# Altium project Dashcam.PrjPcb (part 5 of 8)

## Sheet GNSS_GPS.SchDoc
size A4; DrawnBy: Elio F; Engineer: Elio F; Revision: A; SheetNumber: 17; SheetTotal: 22; Sheet Title: Gnns Gps
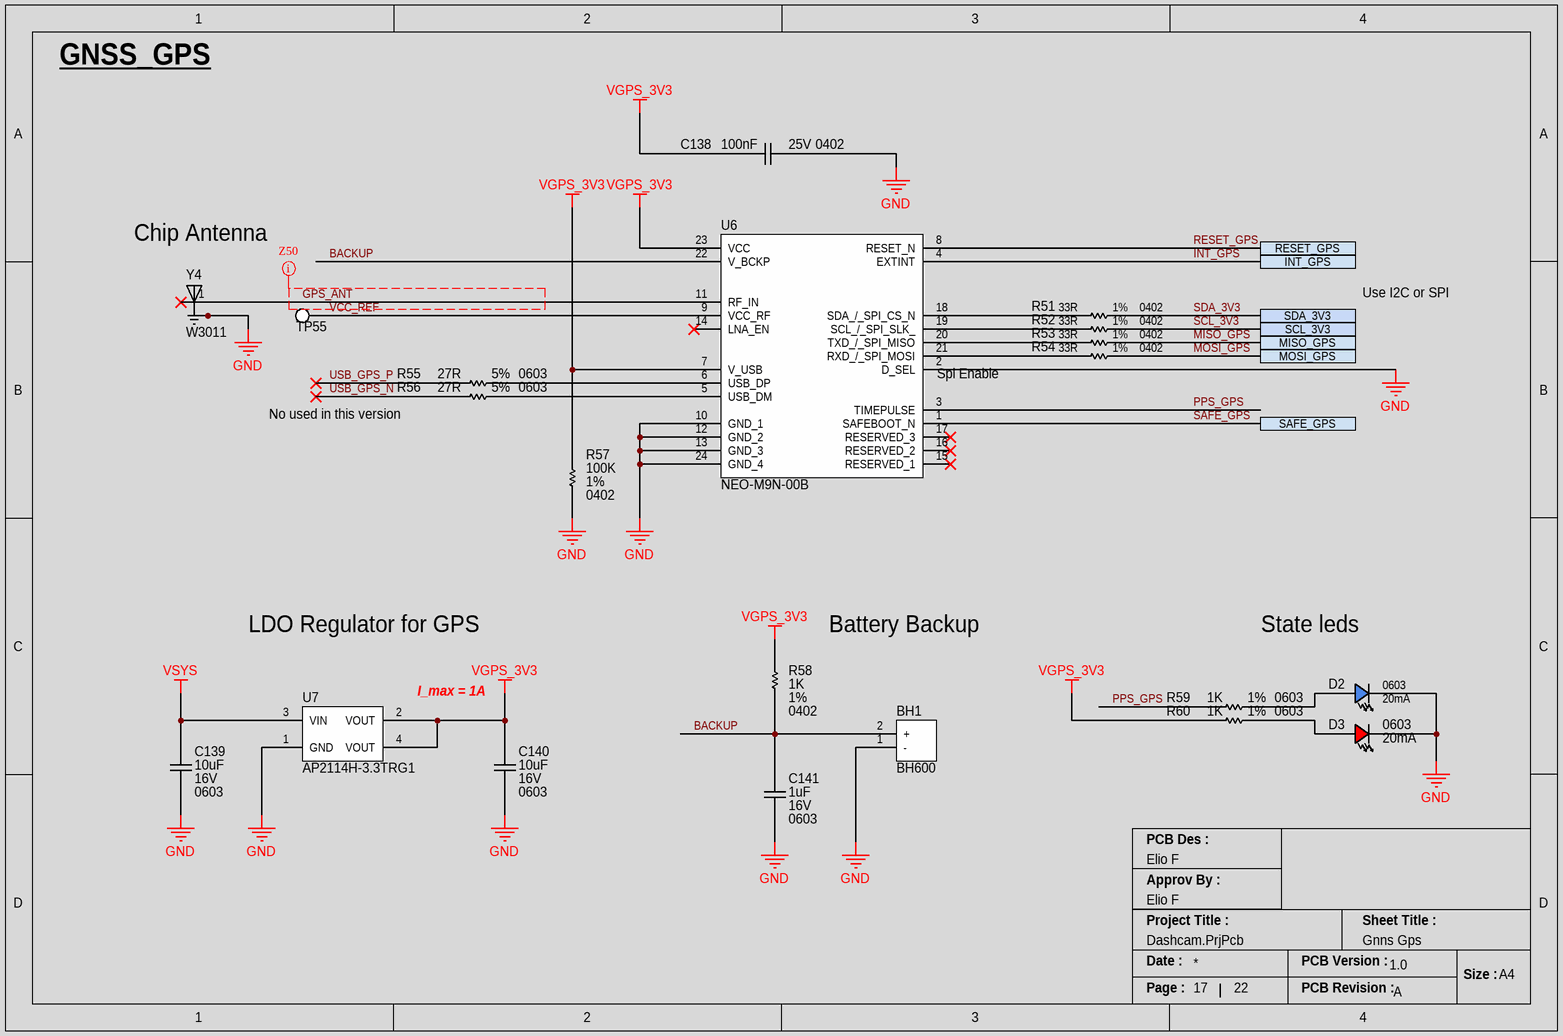
[diagram p14: GNSS_GPS.SchDoc]

### Parts
BH1  BH600  [MECH_BATTERY_HOLDER_BH600]
C138  Capacitance: 100nF  Voltage Rating: 25V  Case/Package: 0402  [CAP_0402_CAPC1005X05N]  (hidden comment: CC0402KRX5R8BB104)
C139  Voltage Rating: 16V  Capacitance: 10uF  Case/Package: 0603  [CAP_0603_CAPC1608X08N]  (hidden comment: GRM188R61C106MAALD)
C140  Voltage Rating: 16V  Capacitance: 10uF  Case/Package: 0603  [CAP_0603_CAPC1608X08N]  (hidden comment: GRM188R61C106MAALD)
C141  Voltage Rating: 16V  Capacitance: 1uF  Case/Package: 0603  [CAP_0603_CAPC1608X08N]  (hidden comment: CL10A105KO8NNNC)
D2  Case/Packcage: 0603  Test Current: 20mA  [LED_0603-BLUE-0.75mm]  (hidden comment: ASCKCB00-NS3T4010302)
D3  Test Current: 20mA  Case/Package: 0603  [LED_0603-RED-0.75mm]  (hidden comment: LTST-C190KRKT)
R51  Tolerance: 1%  Resistance: 33R  Case/Package: 0402  [RES_0402_RESC1005X04N]  (hidden comment: RC0402FR-0733RL)
R52  Tolerance: 1%  Resistance: 33R  Case/Package: 0402  [RES_0402_RESC1005X04N]  (hidden comment: RC0402FR-0733RL)
R53  Tolerance: 1%  Resistance: 33R  Case/Package: 0402  [RES_0402_RESC1005X04N]  (hidden comment: RC0402FR-0733RL)
R54  Tolerance: 1%  Resistance: 33R  Case/Package: 0402  [RES_0402_RESC1005X04N]  (hidden comment: RC0402FR-0733RL)
R55  Tolerance: 5%  Resistance: 27R  Case/Package: 0603  [RES_0603_RESC1608X04N]  (hidden comment: RC0603JR-0727RL)
R56  Tolerance: 5%  Resistance: 27R  Case/Package: 0603  [RES_0603_RESC1608X04N]  (hidden comment: RC0603JR-0727RL)
R57  Resistance: 100K  Tolerance: 1%  Case/Package: 0402  [RES_0402_RESC1005X04N]  (hidden comment: RC0402FR-07100KL)
R58  Resistance: 1K  Tolerance: 1%  Case/Package: 0402  [RES_0402_RESC1005X04N]  (hidden comment: ERJ-2RKF1001X)
R59  Resistance: 1K  Tolerance: 1%  Case/Package: 0603  [RES_0603_RESC1608X04N]  (hidden comment: AC0603FR-101KL)
R60  Resistance: 1K  Tolerance: 1%  Case/Package: 0603  [RES_0603_RESC1608X04N]  (hidden comment: AC0603FR-101KL)
TP55  NO COMPONENT  [TP_PAD_1.6MM_SMD_ROUND]  (value not drawn)  (no BOM)
U6  NEO-M9N-00B  [IC_MODULE_UBLOX_NEOM9N00B]
U7  AP2114H-3.3TRG1  [IC_REG_SOT230P700X180-4N]
Y4  W3011  [ANTENNA_CHIP_XDCR_W3011]

### Ports
INT_GPS, MISO_GPS, MOSI_GPS, RESET_GPS, SAFE_GPS, SCL_3V3, SDA_3V3

### Nets
GND: BH1.1(-) C138.2 C139.1 C140.1 C141.1 D2.1(C) D3.1(C) R57.1 U6.2(D_SEL) U6.10(GND_1) U6.12(GND_2) U6.13(GND_3) U6.24(GND_4) U7.1(GND) Y4.2(GND) Y4.3(GND)
VGPS_3V3: C138.1 C140.2 R57.2 R58.2 R60.1 U6.7(V_USB) U6.23(VCC) U7.2(VOUT) U7.4(VOUT)
VSYS: C139.2 U7.3(VIN)
BACKUP: BH1.2(+) C141.2 R58.1 U6.22(V_BCKP)
GPS_ANT: U6.11(RF_IN) Y4.1(FEED)
INT_GPS: U6.4(EXTINT) ; port INT_GPS
MISO_GPS: R53.2 ; port MISO_GPS
MOSI_GPS: R54.2 ; port MOSI_GPS
PPS_GPS: R59.1 U6.3(TIMEPULSE)
RESET_GPS: U6.8(RESET_N) ; port RESET_GPS
SAFE_GPS: U6.1(SAFEBOOT_N) ; port SAFE_GPS
SCL_3V3: R52.2 ; port SCL_3V3
SDA_3V3: R51.2 ; port SDA_3V3
USB_GPS_N: R56.1
USB_GPS_P: R55.1
VCC_REF: TP55.1 U6.9(VCC_RF)
NetD2_2: D2.2(A) R59.2
NetD3_2: D3.2(A) R60.2
NetR51_1: R51.1 U6.18(SDA_/_SPI_CS_N)
NetR52_1: R52.1 U6.19(SCL_/_SPI_SLK_)
NetR53_1: R53.1 U6.20(TXD_/_SPI_MISO)
NetR54_1: R54.1 U6.21(RXD_/_SPI_MOSI)
NetR55_2: R55.2 U6.6(USB_DP)
NetR56_2: R56.2 U6.5(USB_DM)

Not connected (* = marked no-connect by the designer): U6 14(LNA_EN)* 15(RESERVED_1)* 16(RESERVED_2)* 17(RESERVED_3)*

### Layout directives
net class Z50: GPS_ANT

### Notes on the sheet
- GNSS_GPS
- Chip Antenna
- Use I2C or SPI
- (near U6) Spi Enable
- No used in this version
- LDO Regulator for GPS
- Battery Backup
- State leds
- I_max = 1A
- PCB Des :
- Approv By :
- Project Title :
- Sheet Title :
- Date :
- PCB Version :
- Size :
- A4
- Page :
- PCB Revision :

### Library data of the parts
BH1 = MECH_BATTERY_HOLDER_BH600: Battery Holder 1 Cells Thermoplastic Tray; Manufacturer: Memory Protection Devices; Number of Cells: 1; Supplier 1: Digikey; Manufacturer Part Number: BH600; RoHS: Yes; Category: Batteries and Accessories; Stock 1: 122929; Pricing 1: 1=1.7, 10=1.408, 50=1.236, 100=1.1686, 300=1.06927, 500=1.02602, 1000=0.97012, 2500=0.90087, 5000=0.85178 (USD); Mount: Through Hole,PCB; Min Operating Temperature: -55°C; Max Operating Temperature: 180°C; Series: -; Termination: PC Pin; Diameter: 16mm; Height: 3.2mm; Lead Free: Lead Free; RoHS Compliant: Yes; ComponentLink1URL: https://datasheet.ciiva.com/3/bh600-datasheet-3856.pdf?src-supplier=Digikey; ComponentLink1Description: https://datasheet.ciiva.com/3/bh600-datasheet-3856.pdf?src-supplier=Digikey; Supplier Part Number 1: BH600-ND
C138 = CAP_100NF_25V_X7R_0402: Multilayer Ceramic Capacitor, 0.1 uF, 25 V, ± 10%, X7R, 0402 [1005 Metric]; Manufacturer: Yageo; Material: 4241ConductorMaterial; Dielectric: X5R; Temperature Coefficient: 30ppm/°C; Supplier 1: Digikey; Manufacturer Part Number: CC0402KRX5R8BB104; RoHS: Yes; Category: Ceramic Capacitors; Stock 1: 3706055; Pricing 1: 1=0.1, 10=0.037, 50=0.021, 100=0.0162, 500=0.01224, 1000=0.00961, 2500=0.00874, 5000=0.00804 (USD); Mount: Surface Mount; Case Code (Metric): 1005; Case Code (Imperial): 0402; Min Operating Temperature: -55°C; Max Operating Temperature: 85°C; Tolerance: 10%; Packaging: Tape and Reel; Voltage Rating (DC): 25V; Series: CC; RoHS Compliant: Yes; Lead Free: 5697LeadFree; Halogen Free: 5694HalogenFree; ComponentLink1URL: http://www.mouser.com/ds/2/447/UPY-GPHC_X5R_4V-to-50V_25-1131599.pdf?src-supplier=Mouser; ComponentLink1Description: http://www.mouser.com/ds/2/447/UPY-GPHC_X5R_4V-to-50V_25-1131599.pdf?src-supplier=Mouser; ComponentLink2URL: https://datasheet.octopart.com/CC0402KRX5R8BB104-Yageo-datasheet-137700082.pdf?src-supplier=Future+Electronics; ComponentLink2Description: https://datasheet.octopart.com/CC0402KRX5R8BB104-Yageo-datasheet-137700082.pdf?src-supplier=Future+Electronics; ComponentLink3URL: http://www.yageo.com/documents/recent/UPY-GPHC_X5R_4V-to-50V_25.pdf?src-supplier=Digikey; ComponentLink3Description: http://www.yageo.com/documents/recent/UPY-GPHC_X5R_4V-to-50V_25.pdf?src-supplier=Digikey; ComponentLink4URL: https://datasheet.octopart.com/CC0402KRX5R8BB104-Yageo-datasheet-140260304.pdf?src-supplier=Newark; ComponentLink4Description: https://datasheet.octopart.com/CC0402KRX5R8BB104-Yageo-datasheet-140260304.pdf?src-supplier=Newark; ComponentLink5URL: https://datasheet.octopart.com/CC0402KRX5R8BB104-Yageo-datasheet-170350636.pdf?src-supplier=Future+Electronics; ComponentLink5Description: https://datasheet.octopart.com/CC0402KRX5R8BB104-Yageo-datasheet-170350636.pdf?src-supplier=Future+Electronics; ComponentLink6URL: http://www.yageo.com/documents/recent/UPY-GPHC_X5R_4V-to-50V-16.pdf?src-supplier=Future+Electronics; ComponentLink6Description: http://www.yageo.com/documents/recent/UPY-GPHC_X5R_4V-to-50V-16.pdf?src-supplier=Future+Electronics; Supplier Part Number 1: 311-1697-6-ND
C139 C140 = CAP_10UF_16V_X5R_0603: as C133 on sheet Connector A; Manufacturer Part Number: GRM188R61C106MAALD; RoHS: Yes; Category: Ceramic Capacitors; Stock 1: 566627; Pricing 1: 1=0.24000, 10=0.16500, 50=0.11000, 100=0.09340, 500=0.06596, 1000=0.05771 (USD); Mount: Surface Mount; Case Code (Metric): 1608; Material: Ceramic; Case Code (Imperial): 0603; Min Operating Temperature: -55°C; Max Operating Temperature: 85°C; Tolerance: 20%; Packaging: Cut Tape; Voltage Rating (DC): 16V; Length: 0.063inch; Width: 0.031inch; Height: 0.8mm; Thickness: 0.037inch; Lead Free: Lead Free; RoHS Compliant: Yes; ComponentLink1URL: http://search.murata.co.jp/Ceramy/image/img/A01X/G101/ENG/GRM188R61C106MAAL-01.pdf?src-supplier=Digi-Key; ComponentLink1Description: http://search.murata.co.jp/Ceramy/image/img/A01X/G101/ENG/GRM188R61C106MAAL-01.pdf?src-supplier=Digi-Key; ComponentLink2URL: https://search.murata.co.jp/Ceramy/image/img/A01X/G101/ENG/GRM188R61C106MAAL-01.pdf?src-supplier=Digi-Key; ComponentLink2Description: https://search.murata.co.jp/Ceramy/image/img/A01X/G101/ENG/GRM188R61C106MAAL-01.pdf?src-supplier=Digi-Key; ComponentLink3URL: http://search.murata.co.jp/Ceramy/image/img/A01X/partnumbering_e_01.pdf?src-supplier=Digi-Key; ComponentLink3Description: http://search.murata.co.jp/Ceramy/image/img/A01X/partnumbering_e_01.pdf?src-supplier=Digi-Key; Supplier 1: Digi-Key; Supplier 2: Verical; Supplier 3: Mouser; Supplier Part Number 1: 490-10729-1-ND; Supplier Part Number 2: GRM188R61C106MAALD; Supplier Part Number 3: 81-GRM188R61C106MALD
C141 = CAP_1UF_16V_X5R_0603: CAP CER 1UF 16V X5R 0603; Manufacturer: Samsung; Material: Ceramic; Tolerance: 10%; Manufacturer Part Number: CL10A105KO8NNNC; RoHS: Yes; Category: Ceramic Capacitors; Stock 1: 252255; Pricing 1: 1=0.10000, 10=0.03300, 50=0.01800, 100=0.01470, 500=0.01050, 1000=0.00825 (USD); Mount: Surface Mount; Case Code (Metric): 1608; Case Code (Imperial): 0603; Contact Plating: Tin; Min Operating Temperature: -55°C; Max Operating Temperature: 85°C; Package Quantity: 1; Packaging: Tape and Reel; Dielectric: X5R; Voltage Rating (DC): 16V; Series: CL; Voltage: 16V; Construction: Flat; Length: 1.6mm; Width: 0.031inch; Height: 0.8mm; Thickness: 0.035inch; Depth: 0.8mm; Radiation Hardening: No; Lead Free: Lead Free; RoHS Compliant: Yes; ComponentLink1URL: https://datasheet.ciiva.com/16199/cl10a105ko8nnnc-16199033.pdf?src-supplier=Future+Electronics; ComponentLink1Description: https://datasheet.ciiva.com/16199/cl10a105ko8nnnc-16199033.pdf?src-supplier=Future+Electronics; ComponentLink2URL: https://datasheet.ciiva.com/15195/getdatasheetpartid-359688-15195706.pdf?src-supplier=Verical; ComponentLink2Description: https://datasheet.ciiva.com/15195/getdatasheetpartid-359688-15195706.pdf?src-supplier=Verical; ComponentLink3URL: https://datasheet.ciiva.com/29198/458190-da-01-en-vs-kondensator-0603-29198480.pdf?src-supplier=Conrad; ComponentLink3Description: https://datasheet.ciiva.com/29198/458190-da-01-en-vs-kondensator-0603-29198480.pdf?src-supplier=Conrad; Supplier 1: Digi-Key; Supplier 2: Mouser; Supplier 3: Newark; Supplier Part Number 1: 1276-1034-1-ND; Supplier Part Number 2: 187-CL10A105KO8NNNC; Supplier Part Number 3: 82AC9279
D2 = LED_DIO_BLUE_20mA_0603_ASCKCB00-NS3T4010302: LED Single Chip Blue 467nm 20mA 2-Pin DFN T/R; Manufacturer: Broadcom; Supplier 1: Digikey; Manufacturer Part Number: ASCKCB00-NS3T4010302; RoHS: No; Category: LEDs; Stock 1: 59526; Pricing 1: 1=0.53, 10=0.327, 100=0.1882, 1000=0.14726, 2000=0.13499 (USD); Supplier Part Number 1: 516-ASCKCB00-NS3T4010302CT-ND
D3 = LED_DIO_RED_20mA_0603: LED,  LTST-C190KRKT; Manufacturer: Vishay Lite-On; Color: Red; Lens Color: Colorless; Luminous Intensity: 54mcd; Viewing Angle: 130°; Lens Style: Diffused,Colorless,Clear,Rectangular; Power Rating: 75mW; Dominant Wavelength: 631nm; Lens Transparency: Clear; Number of Elements: 1; Wavelength: 639nm; Reverse Voltage: 5V; Forward Current: 30mA; Forward Voltage: 2.4V; Manufacturer Part Number: LTST-C190KRKT; RoHS: Yes; Category: LEDs; Stock 1: 712361; Pricing 1: 1=0.24000, 10=0.13200, 100=0.06110, 500=0.05640, 1000=0.04418, 2000=0.04324 (USD); Mount: Surface Mount; Number of Pins: 2; Case Code (Metric): 1608; Case Code (Imperial): 0603; Min Operating Temperature: -55°C; Max Operating Temperature: 85°C; Packaging: Tape and Reel; Package Quantity: 1; Illumination Color: Red; Power Dissipation: 75mW; Number of LEDs: 1; Length: 1.6mm; Width: 0.8mm; Height: 0.8mm; Depth: 0.8mm; Radiation Hardening: No; Lead Free: Lead Free; RoHS Compliant: Yes; ComponentLink1URL: https://datasheet.ciiva.com/19482/1260381-19482354.pdf?src-supplier=Jameco; ComponentLink1Description: https://datasheet.ciiva.com/19482/1260381-19482354.pdf?src-supplier=Jameco; ComponentLink2URL: https://datasheet.ciiva.com/12403/100-ltst-c190krkt-59805-12403895.pdf?src-supplier=Mouser; ComponentLink2Description: https://datasheet.ciiva.com/12403/100-ltst-c190krkt-59805-12403895.pdf?src-supplier=Mouser; ComponentLink3URL: https://datasheet.ciiva.com/16427/ltst-c190krkt-16427674.pdf?src-supplier=Future+Electronics; ComponentLink3Description: https://datasheet.ciiva.com/16427/ltst-c190krkt-16427674.pdf?src-supplier=Future+Electronics; ComponentLink4URL: https://datasheet.ciiva.com/15117/getdatasheetpartid-57395-15117240.pdf?src-supplier=Verical; ComponentLink4Description: https://datasheet.ciiva.com/15117/getdatasheetpartid-57395-15117240.pdf?src-supplier=Verical; ComponentLink5URL: https://datasheet.ciiva.com/11774/0900766b80dc02a9-11774043.pdf?src-supplier=Rs; ComponentLink5Description: https://datasheet.ciiva.com/11774/0900766b80dc02a9-11774043.pdf?src-supplier=Rs; ComponentLink6URL: https://datasheet.ciiva.com/2109/s-110-ltst-c190krkt-2109992.pdf?src-supplier=Digi-Key; ComponentLink6Description: https://datasheet.ciiva.com/2109/s-110-ltst-c190krkt-2109992.pdf?src-supplier=Digi-Key; ComponentLink7URL: https://datasheet.ciiva.com/2109/s-110-ltst-c190krkt-2109991.pdf?src-supplier=Digi-Key; ComponentLink7Description: https://datasheet.ciiva.com/2109/s-110-ltst-c190krkt-2109991.pdf?src-supplier=Digi-Key; ComponentLink8URL: https://datasheet.ciiva.com/2109/s-110-ltst-c190krkt-2109993.pdf?src-supplier=Digi-Key; ComponentLink8Description: https://datasheet.ciiva.com/2109/s-110-ltst-c190krkt-2109993.pdf?src-supplier=Digi-Key; ComponentLink9URL: https://datasheet.ciiva.com/26937/getdatasheetpartid-631582-26937958.pdf?src-supplier=Verical; ComponentLink9Description: https://datasheet.ciiva.com/26937/getdatasheetpartid-631582-26937958.pdf?src-supplier=Verical; Supplier 1: Digi-Key; Supplier 2: Mouser; Supplier 3: Arrow Electronics; Supplier Part Number 1: 160-1436-6-ND; Supplier Part Number 2: 859-LTST-C190KRKT; Supplier Part Number 3: LTST-C190KRKT
R51-R54 = RES_33R_1%_62.5mW_0402: SMD Chip Resistor, 33 Ohm, ± 1%, 62.5 mW, 0402 [1005 Metric], Thick Film, General Purpose; Manufacturer: Yageo; Power Rating: 62.5mW; Voltage Rating: 50V; Temperature Coefficient: 100ppm/°C; Max Power Dissipation: 63mW; Supplier 1: Digikey; Manufacturer Part Number: RC0402FR-0733RL; RoHS: Yes; Category: Chip SMD Resistors; Stock 1: 4637808; Pricing 1: 1=0.1, 10=0.015, 50=0.0088, 100=0.0073, 500=0.00488, 1000=0.00417, 5000=0.00297, 10000=0.00261, 20000=0.00231, 30000=0.00216, 50000=0.00199, 100000=0.00179 (USD); Number of Pins: 2; Case Code (Imperial): 0402; Case Code (Metric): 1005; Size Code: 0402; Min Operating Temperature: -55°C; Max Operating Temperature: 155°C; Packaging: Tape and Reel; Voltage Rating (DC): 50V; Package Quantity: 10000; Termination: SMD/SMT; Resistor Type: Thick Film; Features: Moisture Resistant; Series: RC; Number of Terminations: 2; Resistance Tolerance: 1%; Construction: Rectangular; Technology: THICK FILM; Voltage Rating (AC): 50V; Length: 1mm; Width: 0.5mm; Height: 0.35mm; Depth: 0.5mm; Military Standard: Not; Lead Free: Lead Free; RoHS Compliant: Yes; Reach SVHC Compliant: Unknown; ComponentLink1URL: https://datasheet.ciiva.com/11819/0900766b80c66297-11819487.pdf?src-supplier=Rs; ComponentLink1Description: https://datasheet.ciiva.com/11819/0900766b80c66297-11819487.pdf?src-supplier=Rs; ComponentLink2URL: https://datasheet.ciiva.com/7849/1018594-7849966.pdf?src-supplier=Element14; ComponentLink2Description: https://datasheet.ciiva.com/7849/1018594-7849966.pdf?src-supplier=Element14; ComponentLink3URL: https://datasheet.ciiva.com/7849/1018594-7849967.pdf?src-supplier=Element14; ComponentLink3Description: https://datasheet.ciiva.com/7849/1018594-7849967.pdf?src-supplier=Element14; ComponentLink4URL: https://datasheet.ciiva.com/24070/pyu-rc0402-51-rohs-l-6-r-8721-24070077.pdf?src-supplier=Mouser; ComponentLink4Description: https://datasheet.ciiva.com/24070/pyu-rc0402-51-rohs-l-6-r-8721-24070077.pdf?src-supplier=Mouser; Supplier Part Number 1: 311-33.0LRCT-ND
R55 R56 = RES_27R_5%_100mW_0603: Res Thick Film 0603 27 Ohm 5% 0.1W(1/10W) ±100ppm/C Pad SMD T/R; Manufacturer: Yageo; Voltage Rating (DC): 50V; Power Rating: 100mW; Temperature Coefficient: 100ppm/°C; Supplier 1: Digi-Key; Manufacturer Part Number: RC0603JR-0727RL; RoHS: Yes; Category: Chip SMD Resistors; Stock 1: 613178; Pricing 1: 1=0.1, 10=0.016, 50=0.0098, 100=0.0081, 500=0.00542, 1000=0.00462 (USD); Number of Pins: 2; Case Code (Imperial): 0603; Case Code (Metric): 1608; Size Code: 0603; Min Operating Temperature: -55°C; Max Operating Temperature: 155°C; Resistor Type: Thick Film; Voltage Rating: 50V; Packaging: Tape and Reel; Termination: SMD/SMT; Features: Moisture Resistant; Series: RC; Max Power Dissipation: 100mW; Number of Terminations: 2; Resistance Tolerance: 5%; Width: 0.8mm; RoHS Compliant: Yes; Reach SVHC Compliant: No; Lead Free: Lead Free; ComponentLink1URL: https://datasheet.ciiva.com/7746/443971-7746479.pdf?src-supplier=Element14; ComponentLink1Description: https://datasheet.ciiva.com/7746/443971-7746479.pdf?src-supplier=Element14; Supplier Part Number 1: 311-27GRCT-ND
R57 = RES_100K_1%_100mW_0402: SMD Chip Resistor, 100 kOhm, ± 1%, 63 mW, 0402 [1005 Metric], Thick Film, General Purpose; Manufacturer: Yageo; Temperature Coefficient: 100ppm/°C; Power Rating: 63mW; Voltage Rating: 50V; Supplier 1: Digi-Key; Manufacturer Part Number: RC0402FR-07100KL; RoHS: Yes; Category: Chip SMD Resistors; Stock 1: 27579413; Pricing 1: 1=0.1, 10=0.014, 50=0.0084, 100=0.007, 500=0.00464, 1000=0.00396, 5000=0.00282 (USD); Case Code (Metric): 1005; Case Code (Imperial): 0402; Min Operating Temperature: -55°C; Max Operating Temperature: 155°C; Resistor Type: Thick Film; Packaging: Tape and Reel; Package Quantity: 1; Number of Terminations: 2; Termination: SMD/SMT; Max Power Dissipation: 63mW; Features: Moisture Resistant; Series: RC; Resistance Tolerance: 1%; Construction: Rectangular; Technology: THICK FILM; Voltage Rating (AC): 50V; Length: 0.039inch; Width: 0.02inch; Height: 0.016inch; Depth: 0.5mm; Reach SVHC Compliant: No; RoHS Compliant: Yes; Lead Free: 5697LeadFree; Military Standard: Not; ComponentLink1URL: https://datasheet.ciiva.com/11819/0900766b80c66297-11819452.pdf?src-supplier=Rs; ComponentLink1Description: https://datasheet.ciiva.com/11819/0900766b80c66297-11819452.pdf?src-supplier=Rs; ComponentLink2URL: https://datasheet.ciiva.com/22747/1018594-22747509.pdf?src-supplier=Element14; ComponentLink2Description: https://datasheet.ciiva.com/22747/1018594-22747509.pdf?src-supplier=Element14; ComponentLink3URL: https://datasheet.ciiva.com/2453/pyu-r-int-thick-7-2453362.pdf?src-supplier=Digi-Key; ComponentLink3Description: https://datasheet.ciiva.com/2453/pyu-r-int-thick-7-2453362.pdf?src-supplier=Digi-Key; ComponentLink4URL: https://datasheet.ciiva.com/12667/pyu-rc0402-51-rohs-l-6-r-12667930.pdf?src-supplier=Mouser; ComponentLink4Description: https://datasheet.ciiva.com/12667/pyu-rc0402-51-rohs-l-6-r-12667930.pdf?src-supplier=Mouser; ComponentLink5URL: https://datasheet.ciiva.com/15189/getdatasheetpartid-323696-15189334.pdf?src-supplier=Verical; ComponentLink5Description: https://datasheet.ciiva.com/15189/getdatasheetpartid-323696-15189334.pdf?src-supplier=Verical; ComponentLink6URL: https://datasheet.ciiva.com/2453/pyu-r-int-thick-7-2453363.pdf?src-supplier=Digi-Key; ComponentLink6Description: https://datasheet.ciiva.com/2453/pyu-r-int-thick-7-2453363.pdf?src-supplier=Digi-Key; ComponentLink7URL: https://datasheet.ciiva.com/2453/pyu-r-int-thick-7-2453361.pdf?src-supplier=Digi-Key; ComponentLink7Description: https://datasheet.ciiva.com/2453/pyu-r-int-thick-7-2453361.pdf?src-supplier=Digi-Key; Supplier Part Number 1: 311-100KLRCT-ND
R58 = RES_1K_1%_100mW_0402: RES SMD 1K OHM 1% 1/10W 0402; Manufacturer: Panasonic; Temperature Coefficient: 100ppm/°C; Max Power Dissipation: 100mW; Voltage Rating (DC): 50V; Supplier 1: Digi-Key; Manufacturer Part Number: ERJ-2RKF1001X; RoHS: Yes; Category: Chip SMD Resistors; Stock 1: 2367361; Pricing 1: 1=0.1, 10=0.029, 50=0.0162, 100=0.0119, 500=0.00728, 1000=0.00535, 5000=0.00384 (USD); Mount: Surface Mount; Number of Pins: 2; Case Code (Imperial): 0402; Case Code (Metric): 1005; Contact Plating: Tin; Min Operating Temperature: -55°C; Max Operating Temperature: 155°C; Packaging: Tape and Reel; Number of Terminations: 2; Features: Automotive AEC-Q200; Voltage Rating: 50V; Power Rating: 100mW; Package Quantity: 1; Termination: SMD/SMT; Resistor Type: Thick Film; Series: ERJ; Resistance Tolerance: 1%; Construction: Rectangular; Technology: THICK FILM; Length: 1mm; Width: 0.5mm; Height: 0.35mm; Depth: 0.5mm; Lead Free: Lead Free; RoHS Compliant: Yes; Reach SVHC Compliant: Yes; Military Standard: Not; Supplier Part Number 1: P1.00KLCT-ND
R59 R60 = RES_1K_1%_100mW_0603: Chip Resistor Automotive Grade Thick Film 0603 1kOhm 1% Paper T/R; Manufacturer: Yageo; Voltage Rating: 50V; Temperature Coefficient: 100ppm/°C; Power Rating: 100mW; Manufacturer Part Number: AC0603FR-101KL; RoHS: Yes; Category: Chip SMD Resistors; Stock 1: 108593; Pricing 1: 1=0.10000, 10=0.02500, 100=0.01030, 1000=0.00463, 2500=0.00402, 5000=0.00332 (USD); Case Code (Imperial): 0603; Case Code (Metric): 1608; Min Operating Temperature: -55°C; Max Operating Temperature: 155°C; Packaging: Tape and Reel; Termination: SMD/SMT; Series: AC; Length: 1.6mm; Width: 0.8mm; Height: 0.45mm; RoHS Compliant: Yes; ComponentLink1URL: http://www.mouser.com/ds/2/447/yageodocoutput-1111992.pdf?src-supplier=Mouser; ComponentLink1Description: http://www.mouser.com/ds/2/447/yageodocoutput-1111992.pdf?src-supplier=Mouser; Supplier 1: Digi-Key; Supplier 2: Newark; Supplier 3: Mouser; Supplier Part Number 1: 13-AC0603FR-101KLDKR-ND; Supplier Part Number 2: 31AK9289; Supplier Part Number 3: 603-AC0603FR-101KL
TP55 = TP_PAD_SMD_Round: Test Point, SMD pad, round, 1.5mm, 1.6mm, 3mm diameter
U6 = IC_MODULE_UBLOX_NEO-M9N-00B: GNSS module, Flash, TCXO, SAW, LNA, LCC, 12x16 mm Professional Grade; Manufacturer: u-blox; Supplier 1: Mouser; Manufacturer Part Number: NEO-M9N-00B; RoHS: Yes; Category: RF Receivers, Transceivers; Stock 1: 8287; Pricing 1: 1=27, 10=23.92, 50=19.61, 100=15.68, 250=15.68, 1000=15.68, 10000=15.68 (USD); RoHS Compliant: Yes; ComponentLink1URL: https://datasheet.octopart.com/NEO-M9N-00B-u-blox-datasheet-166813760.pdf?src-supplier=Future+Electronics; ComponentLink1Description: https://datasheet.octopart.com/NEO-M9N-00B-u-blox-datasheet-166813760.pdf?src-supplier=Future+Electronics; ComponentLink2URL: https://datasheet.octopart.com/NEO-M9N-00B-u-blox-datasheet-166811447.pdf?src-supplier=TME; ComponentLink2Description: https://datasheet.octopart.com/NEO-M9N-00B-u-blox-datasheet-166811447.pdf?src-supplier=TME; Supplier Part Number 1: 377-NEO-M9N-00B
U7 = IC_REG_LDO_3.3V_1A_AP2114H-3.3TRG1: IC REG LDO 3.3V 1A SOT223; Manufacturer: Diodes; Supplier 1: Digikey; Manufacturer Part Number: AP2114H-3.3TRG1; RoHS: Yes; Category: Voltage Regulators - Linear; Stock 1: 34610; Pricing 1: 1=0.41, 10=0.332, 25=0.304, 100=0.2262, 250=0.20504, 500=0.16968, 1000=0.12726 (USD); ComponentLink1URL: https://datasheet.ciiva.com/29569/ap2114-29569881.pdf?src-supplier=Digikey; ComponentLink1Description: https://datasheet.ciiva.com/29569/ap2114-29569881.pdf?src-supplier=Digikey; ComponentLink2URL: https://datasheet.ciiva.com/29569/ap2114-29569882.pdf?src-supplier=Digikey; ComponentLink2Description: https://datasheet.ciiva.com/29569/ap2114-29569882.pdf?src-supplier=Digikey; ComponentLink3URL: https://datasheet.ciiva.com/29569/ap2114-29569883.pdf?src-supplier=Digikey; ComponentLink3Description: https://datasheet.ciiva.com/29569/ap2114-29569883.pdf?src-supplier=Digikey; Supplier Part Number 1: AP2114H-3.3TRG1DICT-ND
Y4 = ANT_CHIP_GPS_W3011: Antenna Ceramic 3.4dB Gain 1585.42MHz 2-Pin CSMD; Manufacturer: Pulse; Frequency: 1.57542GHz; Impedance: 50R; Number of Bands: 1; Return Loss: -12dB; Max Frequency: 1.58542GHz; Min Frequency: 1.56542GHz; Supplier 1: Digikey; Manufacturer Part Number: W3011; RoHS: Yes; Category: RF Antennas; Stock 1: 8689; Pricing 1: 1=2.56, 10=1.654, 25=1.4148, 100=1.1461, 250=1.01512, 500=0.93512, 1000=0.86859 (USD); Mount: Surface Mount,PCB; Packaging: Cut Tape; Package Quantity: 3000; Termination: Solder; Series: -; Height: 0.043inch; RoHS Compliant: Yes; Lead Free: Lead Free; ComponentLink1URL: https://datasheet.ciiva.com/2792/+w3011-w3011a-2792615.pdf?src-supplier=Digikey; ComponentLink1Description: https://datasheet.ciiva.com/2792/+w3011-w3011a-2792615.pdf?src-supplier=Digikey; ComponentLink2URL: https://datasheet.ciiva.com/8152/+w3011-w3011a-8152997.pdf?src-supplier=Avnet; ComponentLink2Description: https://datasheet.ciiva.com/8152/+w3011-w3011a-8152997.pdf?src-supplier=Avnet; Supplier Part Number 1: 553-2582-1-ND

## Sheet IMU.SchDoc
size A4; DrawnBy: Elio F; Engineer: Elio F; Revision: A; SheetNumber: 18; SheetTotal: 22; Sheet Title: A
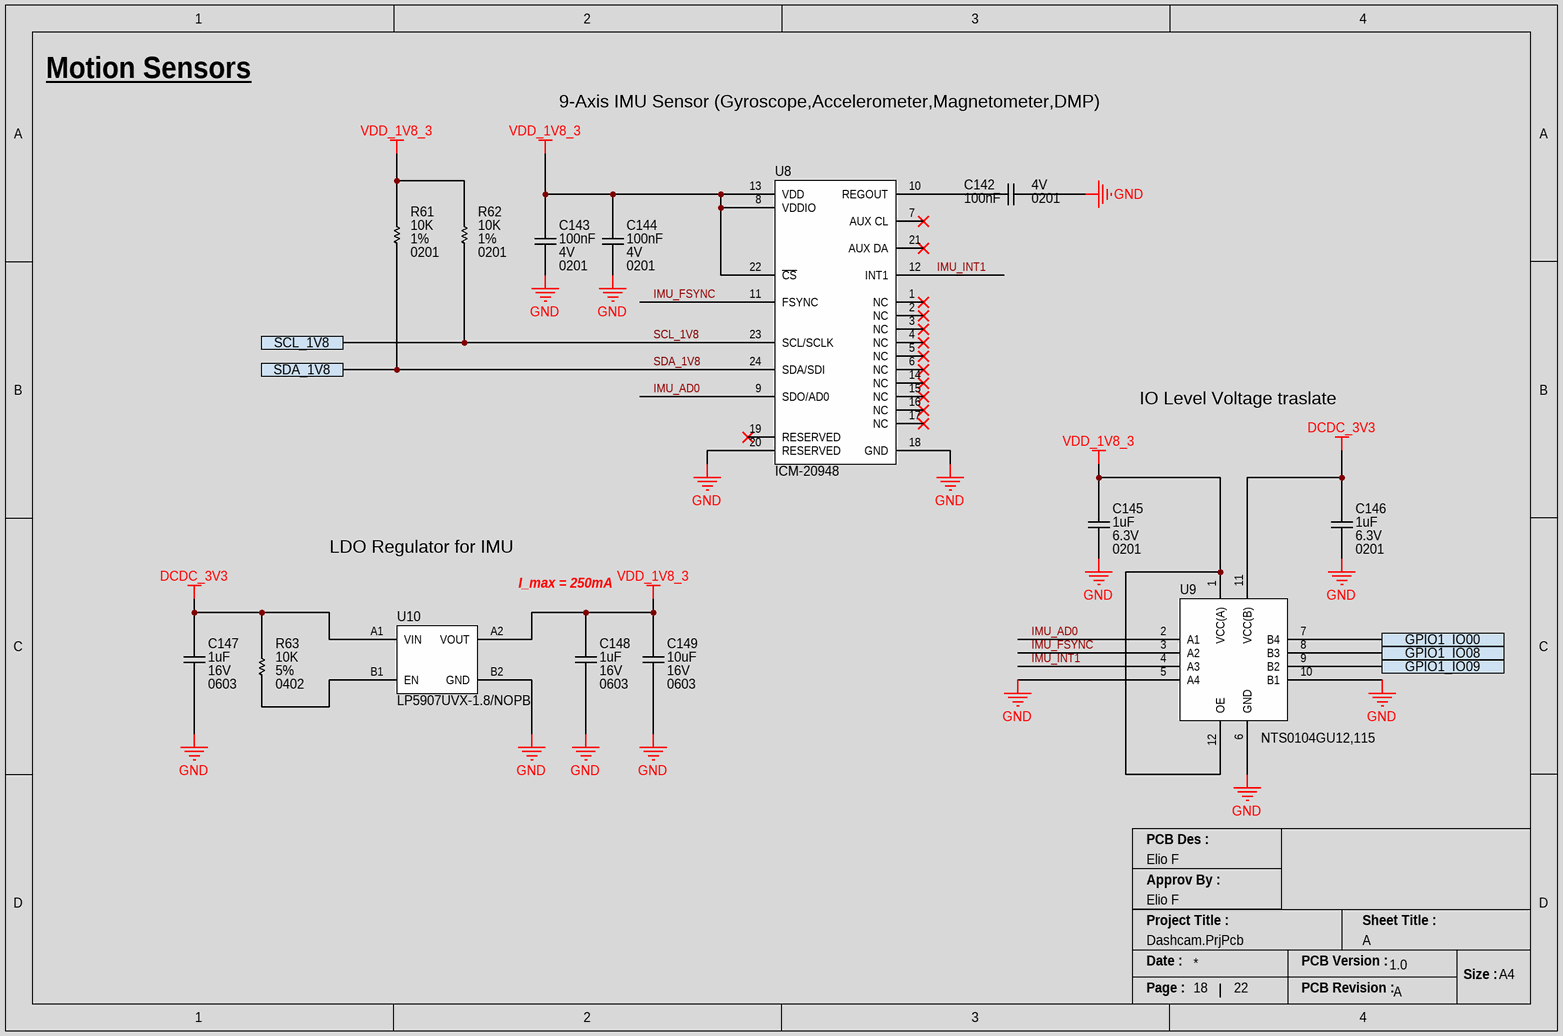
[diagram p15: IMU.SchDoc]

### Parts
C142  Voltage Rating: 4V  Capacitance: 100nF  Case/Package: 0201  [CAP_0201_CAPC0603X03N]  (hidden comment: C0201C104K7PAC7867)
C143  Voltage Rating: 4V  Capacitance: 100nF  Case/Package: 0201  [CAP_0201_CAPC0603X03N]  (hidden comment: C0201C104K7PAC7867)
C144  Voltage Rating: 4V  Capacitance: 100nF  Case/Package: 0201  [CAP_0201_CAPC0603X03N]  (hidden comment: C0201C104K7PAC7867)
C145  Voltage Rating (DC): 6.3V  Capacitance: 1uF  Case/Package: 0201  [CAP_0201_CAPC0603X03N]  (hidden comment: 02016D105MAT2A)
C146  Voltage Rating (DC): 6.3V  Capacitance: 1uF  Case/Package: 0201  [CAP_0201_CAPC0603X03N]  (hidden comment: 02016D105MAT2A)
C147  Voltage Rating: 16V  Capacitance: 1uF  Case/Package: 0603  [CAP_0603_CAPC1608X08N]  (hidden comment: CL10A105KO8NNNC)
C148  Voltage Rating: 16V  Capacitance: 1uF  Case/Package: 0603  [CAP_0603_CAPC1608X08N]  (hidden comment: CL10A105KO8NNNC)
C149  Voltage Rating: 16V  Capacitance: 10uF  Case/Package: 0603  [CAP_0603_CAPC1608X08N]  (hidden comment: GRM188R61C106MAALD)
R61  Tolerance: 1%  Resistance: 10K  Case Code (Imperial): 0201  [RES_0201_RESC0603X02N]  (hidden comment: RC0201FR-0710KL)
R62  Tolerance: 1%  Resistance: 10K  Case Code (Imperial): 0201  [RES_0201_RESC0603X02N]  (hidden comment: RC0201FR-0710KL)
R63  Tolerance: 5%  Resistance: 10K  Case/Package: 0402  [RES_0402_RESC1005X04N]  (hidden comment: ERJ-2GEJ103X)
U8  ICM-20948  [IC_IMU_TDK_InvenSense_0_IPC_A]
U9  NTS0104GU12,115  [IC_LEVEL_TRASLATOR_XQFN12_0P4_1P8X2P1]
U10  LP5907UVX-1.8/NOPB  [IC_REG_LDO_BGA4C35P2X2_71X71X40]

### Ports
GPIO1_IO00, GPIO1_IO08, GPIO1_IO09, SCL_1V8, SDA_1V8

### Nets
DCDC_3V3: C146.2 C147.2 R63.2 U9.11(VCC(B)) U10.A1(VIN)
GND: C142.1 C143.1 C144.1 C145.1 C146.1 C147.1 C148.1 C149.1 U8.18(GND) U8.20(RESERVED) U9.5(A4) U9.6(GND) U9.10(B1) U10.B2(GND)
VDD_1V8_3: C143.2 C144.2 C145.2 C148.2 C149.2 R61.2 R62.2 U8.8(VDDIO) U8.13(VDD) U8.22(~{CS}) U9.1(VCC(A)) U9.12(OE) U10.A2(VOUT)
IMU_AD0: U8.9(SDO/AD0) U9.2(A1)
IMU_FSYNC: U8.11(FSYNC) U9.3(A2)
IMU_INT1: U8.12(INT1) U9.4(A3)
SCL_1V8: R62.1 U8.23(SCL/SCLK) ; port SCL_1V8
SDA_1V8: R61.1 U8.24(SDA/SDI) ; port SDA_1V8
NetC142_2: C142.2 U8.10(REGOUT)
NetR63_1: R63.1 U10.B1(EN)
NetU9_7: U9.7(B4) ; port GPIO1_IO00
NetU9_8: U9.8(B3) ; port GPIO1_IO08
NetU9_9: U9.9(B2) ; port GPIO1_IO09

Not connected (* = marked no-connect by the designer): U8 1(NC)* 2(NC)* 3(NC)* 4(NC)* 5(NC)* 6(NC)* 7(AUX_CL)* 14(NC)* 15(NC)* 16(NC)* 17(NC)* 19(RESERVED)* 21(AUX_DA)*

### Notes on the sheet
- Motion Sensors
- 9-Axis IMU Sensor (Gyroscope,Accelerometer,Magnetometer,DMP)
- IO Level Voltage traslate
- LDO Regulator for IMU
- I_max = 250mA
- PCB Des :
- Approv By :
- Project Title :
- Sheet Title :
- Date :
- PCB Version :
- Size :
- A4
- Page :
- PCB Revision :

### Library data of the parts
C142-C144 = CAP_100NF_4V_X5R_0201: SMD Comm X5R 0201 (0603Metric) ceramic capacitor 0.024Lx0.012W 0.60mmx0.30mm X5R ±10% 0.1muF; Manufacturer: KEMET; Supplier 1: Digikey; Manufacturer Part Number: C0201C104K7PAC7867; RoHS: No; Category: Ceramic Capacitors; Stock 1: 29615; Pricing 1: 1=0.16, 10=0.111, 50=0.0662, 100=0.0521, 500=0.0385, 1000=0.03188, 2500=0.02967, 5000=0.02714 (USD); Mount: Surface Mount; Case Code (Imperial): 0201; Case Code (Metric): 0603; Min Operating Temperature: -55°C; Max Operating Temperature: 85°C; Packaging: Cut Tape; Tolerance: 10%; Series: C; ComponentLink1URL: https://api.kemet.com/component-edge/download/datasheet/C0201C104K7PAC7867.pdf?src-supplier=Digikey; ComponentLink1Description: https://api.kemet.com/component-edge/download/datasheet/C0201C104K7PAC7867.pdf?src-supplier=Digikey; Supplier Part Number 1: 399-14860-6-ND
C145 C146 = CAP_1UF_6.3V_X5R_0201: 0201 1 uF 6.3 V ±20 % Tolerance X5R Surface Mount Multilayer Ceramic Capacitor; Manufacturer: Kyocera AVX; Tolerance: 20%; Supplier 1: Mouser; Manufacturer Part Number: 02016D105MAT2A; RoHS: Yes; Category: Ceramic Capacitors; Stock 1: 1026413; Pricing 1: 1=0.1, 10=0.028, 50=0.028, 100=0.014, 1000=0.008, 10000=0.006 (USD); Mount: Surface Mount; Number of Pins: 2; Case Code (Metric): 0603; Case Code (Imperial): 0201; Min Operating Temperature: -55°C; Max Operating Temperature: 85°C; Packaging: Cut Tape; Series: -; Voltage Rating: 6.3V; Package Quantity: 1; Length: 0.024inch; Width: 0.012inch; Thickness: 0.013inch; Depth: 0.3mm; Lead Free: Lead Free; RoHS Compliant: Yes; Reach SVHC Compliant: No; ComponentLink1URL: https://datasheet.ciiva.com/6265/cx5r-6265595.pdf?src-supplier=Digi-Key; ComponentLink1Description: https://datasheet.ciiva.com/6265/cx5r-6265595.pdf?src-supplier=Digi-Key; ComponentLink2URL: https://datasheet.ciiva.com/1123/1666675-1123122.pdf?src-supplier=Element14; ComponentLink2Description: https://datasheet.ciiva.com/1123/1666675-1123122.pdf?src-supplier=Element14; ComponentLink3URL: https://datasheet.ciiva.com/14891/cx5r-14891029.pdf?src-supplier=Digi-Key; ComponentLink3Description: https://datasheet.ciiva.com/14891/cx5r-14891029.pdf?src-supplier=Digi-Key; ComponentLink4URL: https://datasheet.ciiva.com/7614/cx5r-7614682.pdf?src-supplier=Digi-Key; ComponentLink4Description: https://datasheet.ciiva.com/7614/cx5r-7614682.pdf?src-supplier=Digi-Key; ComponentLink5URL: https://datasheet.ciiva.com/14891/cx5r-14891030.pdf?src-supplier=Digi-Key; ComponentLink5Description: https://datasheet.ciiva.com/14891/cx5r-14891030.pdf?src-supplier=Digi-Key; Supplier Part Number 1: 581-02016D105MAT2A; Dielectric: X5R
C147 C148 = CAP_1UF_16V_X5R_0603: CAP CER 1UF 16V X5R 0603; Manufacturer: Samsung; Material: Ceramic; Tolerance: 10%; Manufacturer Part Number: CL10A105KO8NNNC; RoHS: Yes; Category: Ceramic Capacitors; Stock 1: 252255; Pricing 1: 1=0.10000, 10=0.03300, 50=0.01800, 100=0.01470, 500=0.01050, 1000=0.00825 (USD); Mount: Surface Mount; Case Code (Metric): 1608; Case Code (Imperial): 0603; Contact Plating: Tin; Min Operating Temperature: -55°C; Max Operating Temperature: 85°C; Package Quantity: 1; Packaging: Tape and Reel; Dielectric: X5R; Voltage Rating (DC): 16V; Series: CL; Voltage: 16V; Construction: Flat; Length: 1.6mm; Width: 0.031inch; Height: 0.8mm; Thickness: 0.035inch; Depth: 0.8mm; Radiation Hardening: No; Lead Free: Lead Free; RoHS Compliant: Yes; ComponentLink1URL: https://datasheet.ciiva.com/16199/cl10a105ko8nnnc-16199033.pdf?src-supplier=Future+Electronics; ComponentLink1Description: https://datasheet.ciiva.com/16199/cl10a105ko8nnnc-16199033.pdf?src-supplier=Future+Electronics; ComponentLink2URL: https://datasheet.ciiva.com/15195/getdatasheetpartid-359688-15195706.pdf?src-supplier=Verical; ComponentLink2Description: https://datasheet.ciiva.com/15195/getdatasheetpartid-359688-15195706.pdf?src-supplier=Verical; ComponentLink3URL: https://datasheet.ciiva.com/29198/458190-da-01-en-vs-kondensator-0603-29198480.pdf?src-supplier=Conrad; ComponentLink3Description: https://datasheet.ciiva.com/29198/458190-da-01-en-vs-kondensator-0603-29198480.pdf?src-supplier=Conrad; Supplier 1: Digi-Key; Supplier 2: Mouser; Supplier 3: Newark; Supplier Part Number 1: 1276-1034-1-ND; Supplier Part Number 2: 187-CL10A105KO8NNNC; Supplier Part Number 3: 82AC9279
C149 = CAP_10UF_16V_X5R_0603: 0603 10 uF 16 V ±20% Tolerance X5R Multilayer Ceramic Chip Capacitor; Manufacturer: Murata; Manufacturer Part Number: GRM188R61C106MAALD; RoHS: Yes; Category: Ceramic Capacitors; Stock 1: 566627; Pricing 1: 1=0.24000, 10=0.16500, 50=0.11000, 100=0.09340, 500=0.06596, 1000=0.05771 (USD); Mount: Surface Mount; Case Code (Metric): 1608; Material: Ceramic; Case Code (Imperial): 0603; Min Operating Temperature: -55°C; Max Operating Temperature: 85°C; Tolerance: 20%; Packaging: Cut Tape; Voltage Rating (DC): 16V; Length: 0.063inch; Width: 0.031inch; Height: 0.8mm; Thickness: 0.037inch; Lead Free: Lead Free; RoHS Compliant: Yes; ComponentLink1URL: http://search.murata.co.jp/Ceramy/image/img/A01X/G101/ENG/GRM188R61C106MAAL-01.pdf?src-supplier=Digi-Key; ComponentLink1Description: http://search.murata.co.jp/Ceramy/image/img/A01X/G101/ENG/GRM188R61C106MAAL-01.pdf?src-supplier=Digi-Key; ComponentLink2URL: https://search.murata.co.jp/Ceramy/image/img/A01X/G101/ENG/GRM188R61C106MAAL-01.pdf?src-supplier=Digi-Key; ComponentLink2Description: https://search.murata.co.jp/Ceramy/image/img/A01X/G101/ENG/GRM188R61C106MAAL-01.pdf?src-supplier=Digi-Key; ComponentLink3URL: http://search.murata.co.jp/Ceramy/image/img/A01X/partnumbering_e_01.pdf?src-supplier=Digi-Key; ComponentLink3Description: http://search.murata.co.jp/Ceramy/image/img/A01X/partnumbering_e_01.pdf?src-supplier=Digi-Key; Supplier 1: Digi-Key; Supplier 2: Verical; Supplier 3: Mouser; Supplier Part Number 1: 490-10729-1-ND; Supplier Part Number 2: GRM188R61C106MAALD; Supplier Part Number 3: 81-GRM188R61C106MALD
R61 R62 = RES_10K_1/12W_1%_0201: SMD Chip Resistor, 10 kOhm, ± 1%, 50 mW, 0201 [0603 Metric], Thick Film, General Purpose; Manufacturer: Yageo; Temperature Coefficient: 200ppm/°C; Power Rating: 50mW; Voltage Rating: 25V; Supplier 1: Digikey; Manufacturer Part Number: RC0201FR-0710KL; RoHS: Yes; Category: Chip SMD Resistors; Stock 1: 12030325; Pricing 1: 1=0.1, 10=0.027, 50=0.0172, 100=0.0143, 500=0.00988, 1000=0.00854, 5000=0.00629 (USD); Case/Package: 0201; Number of Pins: 2NUMBER; Contact Plating: Tin,Matte; Case Code (Metric): 0603; Weight: 6E-06oz; Min Operating Temperature: -55°C; Max Operating Temperature: 125°C; Packaging: Tape and Reel; Package Quantity: 10000; Termination: SMD/SMT; Resistor Type: Thick Film; Series: RC; Number of Terminations: 2; Max Power Dissipation: 50mW; Working Voltage: 25V; Features: Moisture Resistant; Technology: THICK FILM; Resistance Tolerance: 1%; Construction: Rectangular; Voltage Rating (DC): 25V; Length: 0.6mm; Width: 0.012inch; Height: 0.01inch; Depth: 0.3mm; RoHS Compliant: Yes; Reach SVHC Compliant: No; Military Standard: Not; Lead Free: 5697LeadFree; ComponentLink1URL: https://datasheet.ciiva.com/7660/1421516-7660807.pdf?src-supplier=Element14; ComponentLink1Description: https://datasheet.ciiva.com/7660/1421516-7660807.pdf?src-supplier=Element14; ComponentLink2URL: https://datasheet.ciiva.com/46391/1421516-46391339.pdf?src-supplier=Element14; ComponentLink2Description: https://datasheet.ciiva.com/46391/1421516-46391339.pdf?src-supplier=Element14; ComponentLink3URL: https://datasheet.ciiva.com/2467/pyu-r-int-thick-7-2467110.pdf?src-supplier=Digikey; ComponentLink3Description: https://datasheet.ciiva.com/2467/pyu-r-int-thick-7-2467110.pdf?src-supplier=Digikey; ComponentLink4URL: https://datasheet.ciiva.com/2467/pyu-r-int-thick-7-2467111.pdf?src-supplier=Digikey; ComponentLink4Description: https://datasheet.ciiva.com/2467/pyu-r-int-thick-7-2467111.pdf?src-supplier=Digikey; ComponentLink5URL: https://datasheet.ciiva.com/2467/pyu-r-int-thick-7-2467109.pdf?src-supplier=Digikey; ComponentLink5Description: https://datasheet.ciiva.com/2467/pyu-r-int-thick-7-2467109.pdf?src-supplier=Digikey; ComponentLink6URL: https://datasheet.ciiva.com/26829/getdatasheetpartid-421074-26829851.pdf?src-supplier=Verical; ComponentLink6Description: https://datasheet.ciiva.com/26829/getdatasheetpartid-421074-26829851.pdf?src-supplier=Verical; ComponentLink7URL: https://datasheet.ciiva.com/8891/pyu-rc0201-51-rohs-l-8-8891384.pdf?src-supplier=Avnet; ComponentLink7Description: https://datasheet.ciiva.com/8891/pyu-rc0201-51-rohs-l-8-8891384.pdf?src-supplier=Avnet; Supplier Part Number 1: 311-10.0KMCT-ND
R63 = RES_10K_5%_100mW_0402: Res Thick Film 0402 10K Ohm 5% 1/10W ±200ppm/°C Molded SMD Punched Carrier T/R; Manufacturer: Panasonic; Power Rating: 100mW; Voltage Rating: 50V; Supplier 1: Digi-Key; Manufacturer Part Number: ERJ-2GEJ103X; RoHS: Yes; Category: Chip SMD Resistors; Stock 1: 4696986; Pricing 1: 1=0.1, 10=0.021, 50=0.0132, 100=0.011, 500=0.00744, 1000=0.00639, 5000=0.00464 (USD); Mount: Surface Mount; Contact Plating: Tin; Case Code (Metric): 1005; Case Code (Imperial): 0402; Size Code: 0402; Min Operating Temperature: -55°C; Max Operating Temperature: 155°C; Temperature Coefficient: 200ppm/°C; Packaging: Cut Tape; Resistor Type: Thick Film; Package Quantity: 10000; Number of Terminations: 2; Termination: SMD/SMT; Max Power Dissipation: 100mW; Features: Automotive AEC-Q200; Series: ERJ; Resistance Tolerance: 5%; Technology: THICK FILM; Voltage Rating (DC): 50V; Length: 1mm; Width: 0.5mm; Height: 0.35mm; Depth: 0.5mm; Ratings: AEC-Q200; Radiation Hardening: No; Reach SVHC Compliant: No; RoHS Compliant: Yes; Lead Free: 5697LeadFree; ComponentLink1URL: https://datasheet.ciiva.com/27055/1935721-27055112.pdf?src-supplier=Jameco; ComponentLink1Description: https://datasheet.ciiva.com/27055/1935721-27055112.pdf?src-supplier=Jameco; ComponentLink2URL: https://datasheet.ciiva.com/11821/0900766b80f806dd-11821170.pdf?src-supplier=Rs; ComponentLink2Description: https://datasheet.ciiva.com/11821/0900766b80f806dd-11821170.pdf?src-supplier=Rs; ComponentLink3URL: https://datasheet.ciiva.com/43460/1678796-43460391.pdf?src-supplier=Farnell; ComponentLink3Description: https://datasheet.ciiva.com/43460/1678796-43460391.pdf?src-supplier=Farnell; ComponentLink4URL: https://datasheet.ciiva.com/22785/1678796-22785949.pdf?src-supplier=Farnell; ComponentLink4Description: https://datasheet.ciiva.com/22785/1678796-22785949.pdf?src-supplier=Farnell; ComponentLink5URL: https://datasheet.ciiva.com/46371/1678796-46371910.pdf?src-supplier=Element14; ComponentLink5Description: https://datasheet.ciiva.com/46371/1678796-46371910.pdf?src-supplier=Element14; ComponentLink6URL: https://datasheet.ciiva.com/28514/1678796-28514154.pdf?src-supplier=Element14; ComponentLink6Description: https://datasheet.ciiva.com/28514/1678796-28514154.pdf?src-supplier=Element14; ComponentLink7URL: https://datasheet.ciiva.com/24070/aoa0000ce1-37422-24070679.pdf?src-supplier=Mouser; ComponentLink7Description: https://datasheet.ciiva.com/24070/aoa0000ce1-37422-24070679.pdf?src-supplier=Mouser; ComponentLink8URL: https://datasheet.ciiva.com/16767/70260739-16767130.pdf?src-supplier=Allied+Electronics; ComponentLink8Description: https://datasheet.ciiva.com/16767/70260739-16767130.pdf?src-supplier=Allied+Electronics; ComponentLink9URL: https://datasheet.ciiva.com/16774/70260739-16774504.pdf?src-supplier=Allied+Electronics; ComponentLink9Description: https://datasheet.ciiva.com/16774/70260739-16774504.pdf?src-supplier=Allied+Electronics; ComponentLink10URL: https://datasheet.ciiva.com/9194/aoa0000ce1-9194140.pdf?src-supplier=Avnet; ComponentLink10Description: https://datasheet.ciiva.com/9194/aoa0000ce1-9194140.pdf?src-supplier=Avnet; Supplier Part Number 1: P10KJCT-ND
U8 = IC_IMU_9AXIS_ICM-20948: IMU (Inertial Measurement Unit), 9-Axis, Accelerometer, Gyroscope, Compass; Manufacturer: TDK; Sensor Type: Accelerometer,Gyroscope,Magnetometer; Output Type: SPI,I2C; Max Supply Voltage: 3.6V; Min Supply Voltage: 1.71V; Supplier 1: Mouser; Manufacturer Part Number: ICM-20948; RoHS: Yes; Category: Inertial Measurement Units (IMUs); Stock 1: 38177; Pricing 1: 1=8.32, 10=6.38, 50=6.38, 100=5.45, 250=5.41, 500=5.13, 1000=4.8, 2500=4.76, 5000=4.61, 10000=4.61 (USD); Mount: Surface Mount; Case/Package: QFN; Min Operating Temperature: -40°C; Max Operating Temperature: 85°C; Series: -; Packaging: Cut Tape; Length: 3mm; Width: 3mm; Height: 1.05mm; ComponentLink1URL: http://www.farnell.com/datasheets/2632662.pdf?src-supplier=Farnell; ComponentLink1Description: http://www.farnell.com/datasheets/2632662.pdf?src-supplier=Farnell; ComponentLink2URL: https://www.invensense.com/wp-content/uploads/2016/06/App-Note-eMD-20x48-User-Guide.pdf?src-supplier=Digikey; ComponentLink2Description: https://www.invensense.com/wp-content/uploads/2016/06/App-Note-eMD-20x48-User-Guide.pdf?src-supplier=Digikey; ComponentLink3URL: http://www.farnell.com/datasheets/2632662.pdf?src-supplier=Element14; ComponentLink3Description: http://www.farnell.com/datasheets/2632662.pdf?src-supplier=Element14; ComponentLink4URL: http://www.farnell.com/datasheets/2632662.pdf?src-supplier=Newark; ComponentLink4Description: http://www.farnell.com/datasheets/2632662.pdf?src-supplier=Newark; ComponentLink5URL: https://www.invensense.com/wp-content/uploads/2016/06/App-Note-eMD-20x48-User-Guide.pdf?src-supplier=Avnet; ComponentLink5Description: https://www.invensense.com/wp-content/uploads/2016/06/App-Note-eMD-20x48-User-Guide.pdf?src-supplier=Avnet; ComponentLink6URL: https://www.invensense.com/wp-content/uploads/2016/06/App-Note-eMD-20x48-User-Guide.pdf?src-supplier=Component+Distributors+Inc.; ComponentLink6Description: https://www.invensense.com/wp-content/uploads/2016/06/App-Note-eMD-20x48-User-Guide.pdf?src-supplier=Component+Distributors+Inc.; Supplier Part Number 1: 410-ICM-20948
U9 = IC_LEVEL_TRASLATOR_NTS0104GU12,115: NTS0104 Series 50 Mbps Dual Supply 3-ST O-DRN Translating Transceiver- XQFN-12; Manufacturer: NXP Semiconductors; Logic Function: Translator; Low Level Output Current: 1mA; High Level Output Current: -20uA; Quiescent Current: 45uA; Data Rate: 50Mbps; Number of Channels: 4; Propagation Delay: 4.4ns; Max Supply Voltage: 5.5V; Min Supply Voltage: 1.65V; Max Power Dissipation: 250mW; Turn-On Delay Time: 5.8ns; Output Type: Voltage; Supplier 1: Digikey; Manufacturer Part Number: NTS0104GU12,115; RoHS: Yes; Category: Voltage Level Shifters; Stock 1: 126626; Pricing 1: 1=1.16, 10=1.034, 25=0.982, 100=0.8065, 250=0.75396, 500=0.66628, 1000=0.52601 (USD); Mount: Surface Mount; Number of Pins: 12; Min Operating Temperature: -40°C; Max Operating Temperature: 125°C; Packaging: Tape and Reel; Package Quantity: 1; Number of Bits: 4; Series: -; Lead Free: Lead Free; RoHS Compliant: Yes; ComponentLink1URL: https://datasheet.ciiva.com/1899/nts0104-1899088.pdf?src-supplier=Digikey; ComponentLink1Description: https://datasheet.ciiva.com/1899/nts0104-1899088.pdf?src-supplier=Digikey; ComponentLink2URL: https://datasheet.ciiva.com/4834/nts0104-92130-4834865.pdf?src-supplier=Mouser; ComponentLink2Description: https://datasheet.ciiva.com/4834/nts0104-92130-4834865.pdf?src-supplier=Mouser; ComponentLink3URL: https://datasheet.ciiva.com/1899/nts0104-1899089.pdf?src-supplier=Digikey; ComponentLink3Description: https://datasheet.ciiva.com/1899/nts0104-1899089.pdf?src-supplier=Digikey; ComponentLink4URL: https://datasheet.ciiva.com/1899/nts0104-1899090.pdf?src-supplier=Digikey; ComponentLink4Description: https://datasheet.ciiva.com/1899/nts0104-1899090.pdf?src-supplier=Digikey; ComponentLink5URL: https://datasheet.ciiva.com/8244/nts0104-8244168.pdf?src-supplier=Avnet; ComponentLink5Description: https://datasheet.ciiva.com/8244/nts0104-8244168.pdf?src-supplier=Avnet; Supplier Part Number 1: 568-8408-1-ND
U10 = IC_REG_LDO_1.8V_250mA_LP5907UVX-1.8/NOPB: Low Dropout Regulators(LDO) Positive Fixed 200mV @ 250mA 5.5V 1.8V 250mA DSBGA-4 RoHS; Manufacturer: Texas Instruments; Number of Outputs: 1; Min Input Voltage: 2.2V; Quiescent Current: 25uA; Accuracy: 2%; Dropout Voltage: 50mV; Max Supply Current: 425uA; Power Supply Rejection Ratio (PSRR): 60dB; Supplier 1: Digikey; Manufacturer Part Number: LP5907UVX-1.8/NOPB; RoHS: Yes; Category: Voltage Regulators - Linear; Stock 1: 47909; Pricing 1: 1=0.66, 10=0.564, 25=0.5268, 100=0.4214, 250=0.39128, 500=0.33108, 1000=0.25583 (USD); Mount: Surface Mount; Case/Package: SMD/SMT; Min Operating Temperature: -40°C; Max Operating Temperature: 125°C; Package Quantity: 3000; Packaging: Tape and Reel; Max Input Voltage: 5.5V; Max Output Current: 250mA; Output Voltage: 1.8V; Polarity: Positive; Output Type: Fixed; Series: -; Output Configuration: Positive; Number of Regulators: 1; Min Output Voltage: 1.8V; Output Current: 250mA; Radiation Hardening: No; Lead Free: Lead Free; RoHS Compliant: Yes; ComponentLink1URL: https://datasheet.ciiva.com/6597/lp5907-6597398.pdf?src-supplier=Digikey; ComponentLink1Description: https://datasheet.ciiva.com/6597/lp5907-6597398.pdf?src-supplier=Digikey; ComponentLink2URL: https://datasheet.ciiva.com/14278/lp5907-14278557.pdf?src-supplier=Avnet; ComponentLink2Description: https://datasheet.ciiva.com/14278/lp5907-14278557.pdf?src-supplier=Avnet; Supplier Part Number 1: 296-35634-1-ND